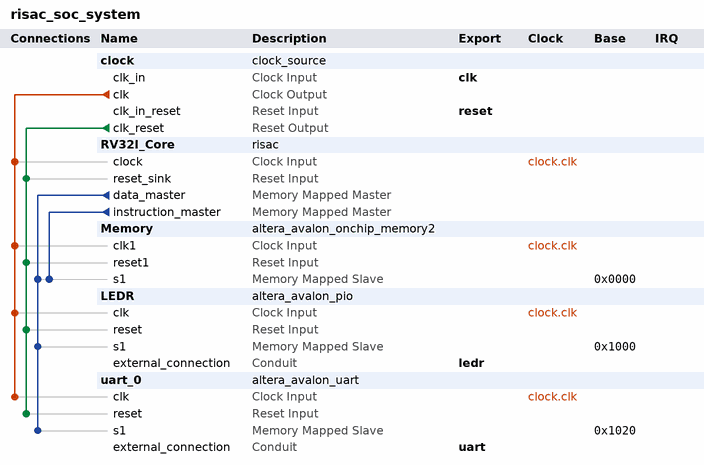
[diagram p0: system contents]
# Platform Designer (Qsys) system risac_soc_system, Cyclone II EP2C35F672C7
# Parameters at their usual value, and those the tool derives, are not listed.
package require -exact qsys 13.0.1
create_system risac_soc_system
set_project_property DEVICE_FAMILY {Cyclone II}
set_project_property DEVICE EP2C35F672C7

add_instance clock clock_source 13.0
set_instance_parameter_value clock clockFrequency 50000000

add_instance RV32I_Core risac 1.0

add_instance Memory altera_avalon_onchip_memory2 13.0.1
set_instance_parameter_value Memory dataWidth 32
set_instance_parameter_value Memory dualPort false
set_instance_parameter_value Memory initMemContent true
set_instance_parameter_value Memory initializationFileName mem.hex
set_instance_parameter_value Memory memorySize 4096
set_instance_parameter_value Memory useNonDefaultInitFile true

add_instance LEDR altera_avalon_pio 13.0.1
set_instance_parameter_value LEDR direction Output
set_instance_parameter_value LEDR width 10

add_instance uart_0 altera_avalon_uart 13.0.1
set_instance_parameter_value uart_0 baud 115200
set_instance_parameter_value uart_0 dataBits 8
set_instance_parameter_value uart_0 fixedBaud true
set_instance_parameter_value uart_0 parity NONE
set_instance_parameter_value uart_0 stopBits 1

# connections
add_connection clock.clk LEDR.clk clock
add_connection clock.clk Memory.clk1 clock
add_connection clock.clk RV32I_Core.clock clock
add_connection clock.clk uart_0.clk clock
add_connection clock.clk_reset LEDR.reset reset
add_connection clock.clk_reset Memory.reset1 reset
add_connection clock.clk_reset RV32I_Core.reset_sink reset
add_connection clock.clk_reset uart_0.reset reset
add_connection RV32I_Core.data_master LEDR.s1 avalon
set_connection_parameter_value RV32I_Core.data_master/LEDR.s1 baseAddress 0x1000
add_connection RV32I_Core.data_master Memory.s1 avalon
set_connection_parameter_value RV32I_Core.data_master/Memory.s1 baseAddress 0x0000
add_connection RV32I_Core.data_master uart_0.s1 avalon
set_connection_parameter_value RV32I_Core.data_master/uart_0.s1 baseAddress 0x1020
add_connection RV32I_Core.instruction_master Memory.s1 avalon
set_connection_parameter_value RV32I_Core.instruction_master/Memory.s1 baseAddress 0x0000

# exported interfaces
add_interface clk clock sink
set_interface_property clk EXPORT_OF clock.clk_in
add_interface reset reset sink
set_interface_property reset EXPORT_OF clock.clk_in_reset
add_interface ledr conduit end
set_interface_property ledr EXPORT_OF LEDR.external_connection
add_interface uart conduit end
set_interface_property uart EXPORT_OF uart_0.external_connection

set_interconnect_requirement {$system} qsys_mm.clockCrossingAdapter HANDSHAKE
set_interconnect_requirement {$system} qsys_mm.maxAdditionalLatency 1

save_system risac_soc_system.qsys
